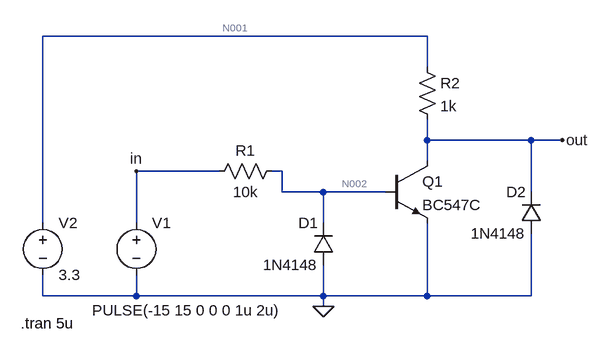
[diagram p0: schematic Pegelwandler.asc]
Pegelwandler.asc, the LTspice schematic file:
Version 4
SHEET 1 880 680
WIRE 432 -160 -160 -160
WIRE 432 -112 432 -160
WIRE 432 0 432 -32
WIRE 592 0 432 0
WIRE 640 0 592 0
WIRE 432 32 432 0
WIRE 112 48 -16 48
WIRE 208 48 192 48
WIRE 208 80 208 48
WIRE 272 80 208 80
WIRE 368 80 272 80
WIRE 592 80 592 0
WIRE -160 128 -160 -160
WIRE -16 128 -16 48
WIRE 272 128 272 80
WIRE -160 240 -160 208
WIRE -16 240 -16 208
WIRE -16 240 -160 240
WIRE 272 240 272 192
WIRE 272 240 -16 240
WIRE 432 240 432 128
WIRE 432 240 272 240
WIRE 592 240 592 144
WIRE 592 240 432 240
WIRE 272 256 272 240
FLAG 272 256 0
FLAG 640 0 out
FLAG -16 48 in
SYMBOL voltage -16 112 R0
WINDOW 3 -68 150 Left 2
WINDOW 123 0 0 Left 0
WINDOW 39 0 0 Left 0
SYMATTR InstName V1
SYMATTR Value PULSE(-15 15 0 0 0 1u 2u)
SYMBOL npn 368 32 R0
SYMATTR InstName Q1
SYMATTR Value BC547C
SYMBOL res 208 32 R90
WINDOW 0 0 56 VBottom 2
WINDOW 3 32 56 VTop 2
SYMATTR InstName R1
SYMATTR Value 10k
SYMBOL voltage -160 112 R0
WINDOW 123 0 0 Left 0
WINDOW 39 0 0 Left 0
SYMATTR InstName V2
SYMATTR Value 3.3
SYMBOL res 416 -128 R0
SYMATTR InstName R2
SYMATTR Value 1k
SYMBOL diode 288 192 R180
WINDOW 0 24 64 Left 2
WINDOW 3 24 0 Left 2
SYMATTR InstName D1
SYMATTR Value 1N4148
SYMBOL diode 608 144 R180
WINDOW 0 24 64 Left 2
WINDOW 3 24 0 Left 2
SYMATTR InstName D2
SYMATTR Value 1N4148
TEXT -194 282 Left 2 !.tran 5u

The netlist it stands for:
* Pegelwandler.asc
V1 in 0 PULSE(-15 15 0 0 0 1u 2u)
Q1 out N002 0 0 BC547C
R1 N002 in 10k
V2 N001 0 3.3
R2 N001 out 1k
D1 0 N002 1N4148
D2 0 out 1N4148
.model D D
.lib standard.dio
.model NPN NPN
.model PNP PNP
.lib standard.bjt
.tran 5u
.backanno
.end

* Results of the author's LTspice run, read from the files saved beside the schematic
* Operating Point, zero values left out:
*   V(in) = -15 V
*   V(out) = 3.3 V
*   V(n002) = -601.5 mV
*   V(n001) = 3.3 V
*   Ic(Q1) = 3.929 pA
*   Ib(Q1) = -4.533 pA
*   I(D2) = -2.523 nA
*   I(D1) = 1.44 mA
*   I(R2) = 2.527 nA
*   I(R1) = 1.44 mA
*   I(V2) = -2.527 nA
*   I(V1) = 1.44 mA
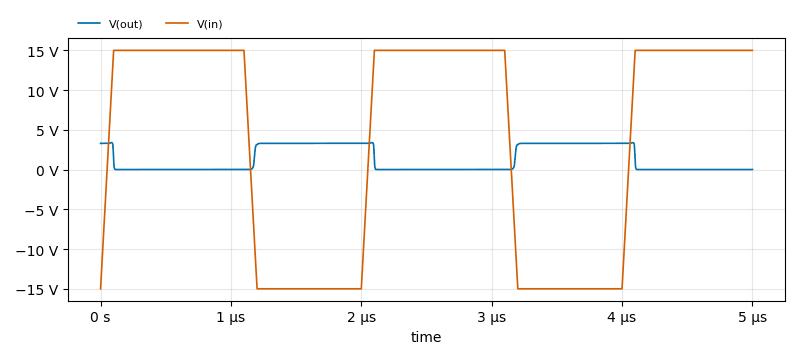
[diagram p1: Transient Analysis of Pegelwandler.asc, plotted from the saved traces]
* Transient Analysis, 1 run:
*   V(out): min 7.812 mV, max 3.39 V, average 1.284 V, rms 2.046 V, last 7.823 mV
*   V(in): min -15 V, max 15 V, average 3.9 V, rms 14.49 V, last 15 V